# EAGLE design smartdoor (EAGLE 8.2.1)
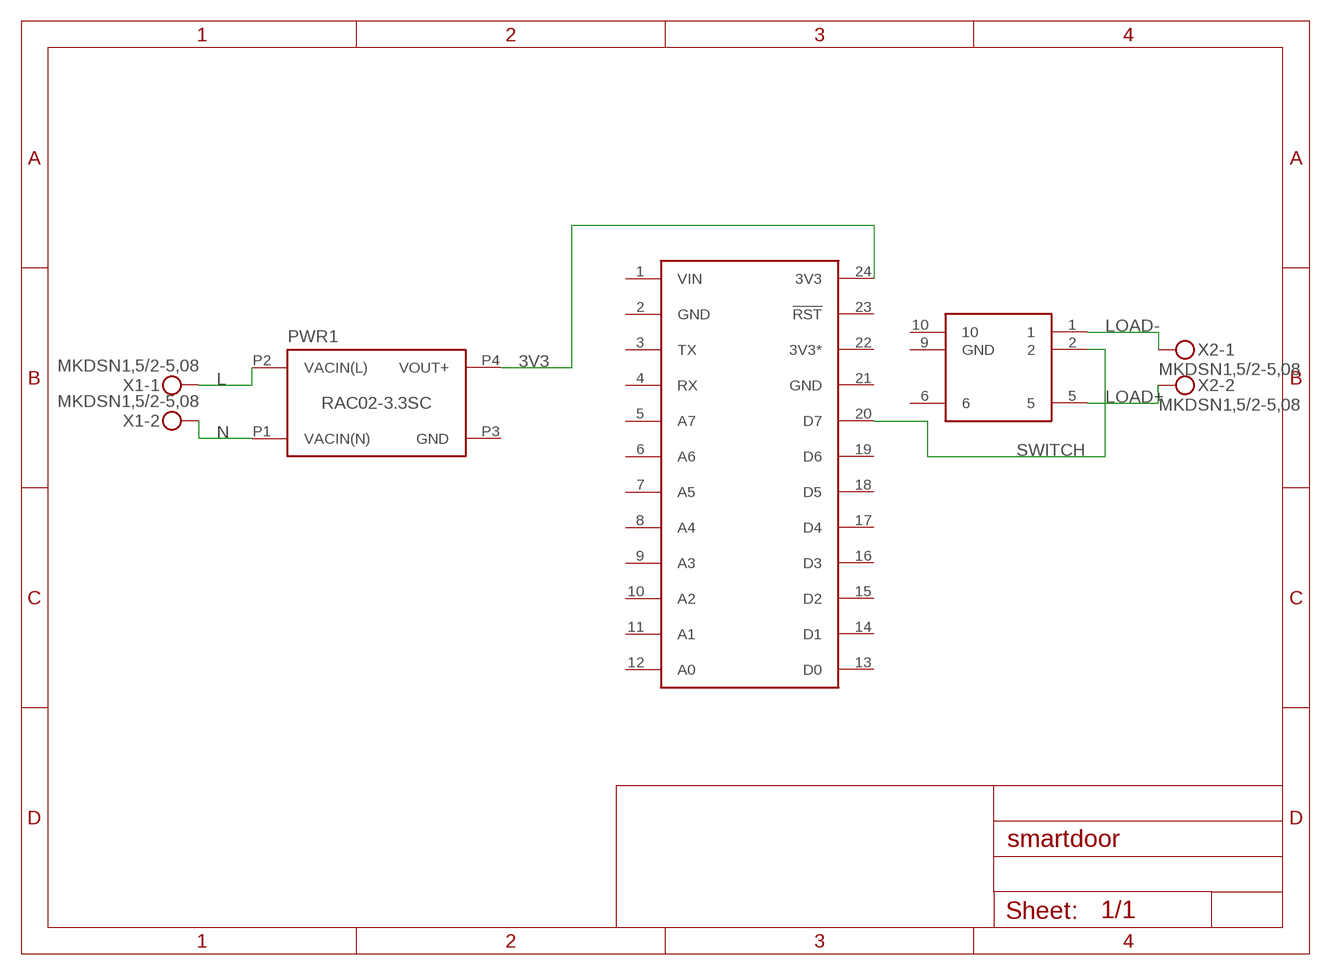
[diagram p0: schematic, sheet 1]

## Parts
CORE  SPARK_CORECORE  [SPARK_CORE]
PWR1  RAC02-3.3SC  [LOW_PROFILE_POWER_MODULE]
RELAY1  AZ9571AZ9571  [AZ9571]
X1  MKDSN1,5/2-5,08  [MKDSN1,5/2-5,08]
X2  MKDSN1,5/2-5,08  [MKDSN1,5/2-5,08]

## Nets
3V3: CORE.24(3V3) PWR1.P4(VOUT+)
L [hivoltage]: PWR1.P2(VACIN(L)) X1.1
LOAD+: RELAY1.5 X2.2
LOAD-: RELAY1.1 X2.1
N [hivoltage]: PWR1.P1(VACIN(N)) X1.2
SWITCH: CORE.20(D7) RELAY1.2
Unconnected: CORE.3(TX) CORE.4(RX) CORE.5(A7) CORE.6(A6) CORE.7(A5) CORE.8(A4) CORE.9(A3) CORE.10(A2) CORE.11(A1) CORE.12(A0) CORE.13(D0) CORE.14(D1) CORE.15(D2) CORE.16(D3) CORE.17(D4) CORE.18(D5) CORE.19(D6) CORE.23(!RST) RELAY1.6 RELAY1.10

## Power pins joined to a net without a drawn wire
3V3*: CORE.22(3V3*)
GND: CORE.2(GND) CORE.21(GND) PWR1.P3(GND) RELAY1.9(GND)
VIN: CORE.1(VIN)

## Library data of the parts
CORE = Particle:SPARK_CORE
PWR1 = recom-powerline-acdc-converters:RAC*SC: RECOM POWERLINE AC/DC-Converter (RAC01-SC and RAC02-SC series) The RAC01-SC and RAC02-SC series are ultra-compact universal input AC/DC power modules for PCB mounting. They feature high efficiency, low standby power, high operating temperature, soft start and short-circuit protection as well as a built-in EMC Class B filter. Output voltages range from 3.3VDC to 24VDC. Datasheet <http://www.recom-power.com/pdf/Powerline-AC-DC/RAC01_02-SC.pdf>; INPUT_RANGE: 80 - 277 (VAC); MAX_CAPACITIVE_LOAD: 2000uF; OUTPUT_CURRENT: 600mA; OUTPUT_VOLTAGE: 3.3v
RELAY1 = Zettler:AZ9571
X1 X2 = con-phoenix-508:MKDSN1,5/2-5,08: MKDSN 1,5/ 2-5,08 Printklemme Nennstrom: 13,5 A Nennspannung: 250 V Rastermaß: 5,08 mm Polzahl: 2 Anschlussart: Schraubanschluss Montage: Löten Anschlussrichtung Leiter/Platine: 0 ° Artikelnummer: 1729128 Source: http://eshop.phoenixcontact.com .. 1729128.pdf

## Net classes
0 default: width 0.61 mm, drill 0.61 mm, clearance 0.61 mm
1 hivoltage: width 1.016 mm, drill 0.61 mm, clearance 1.016 mm

## Board
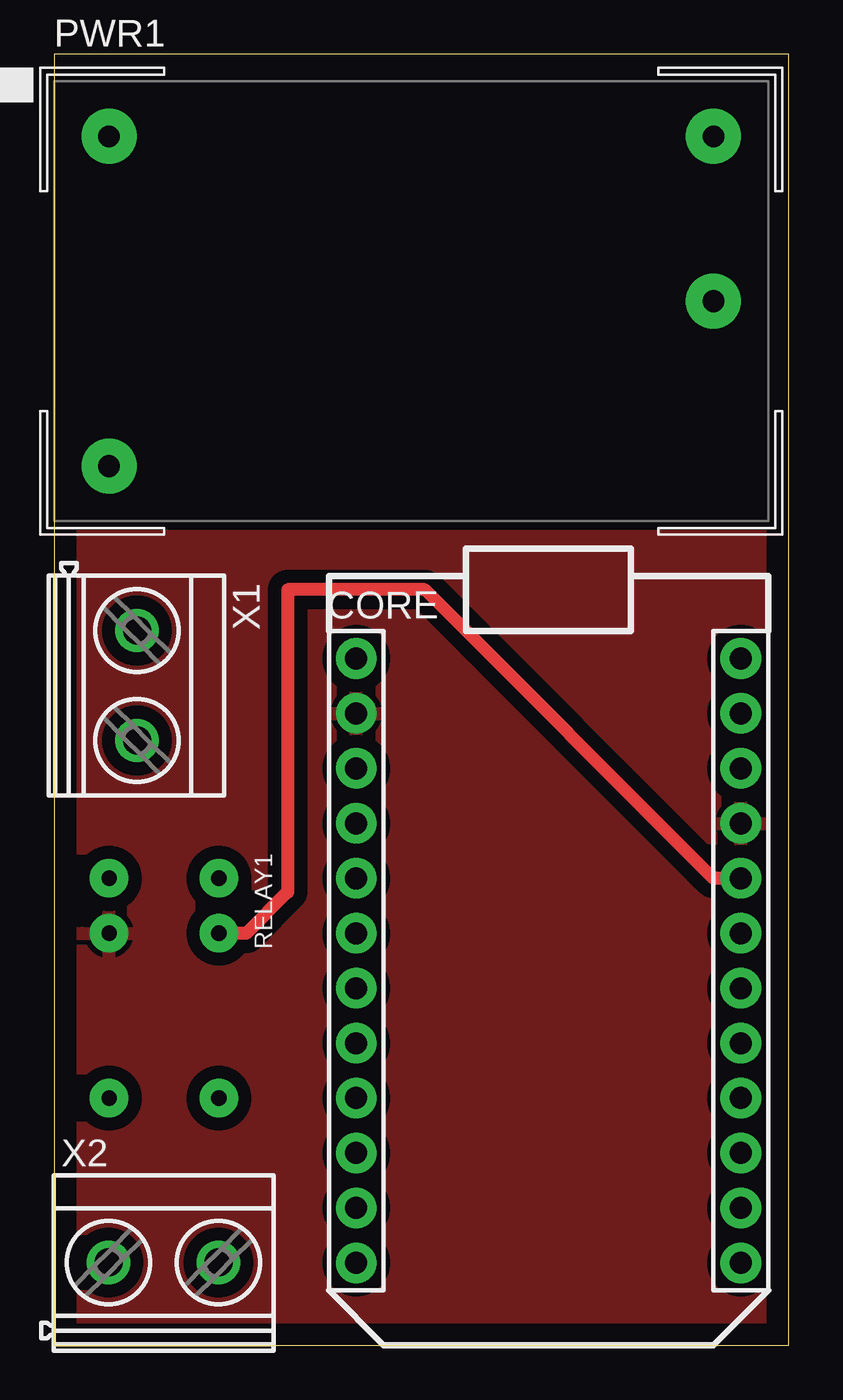
[diagram p1: board, top side]
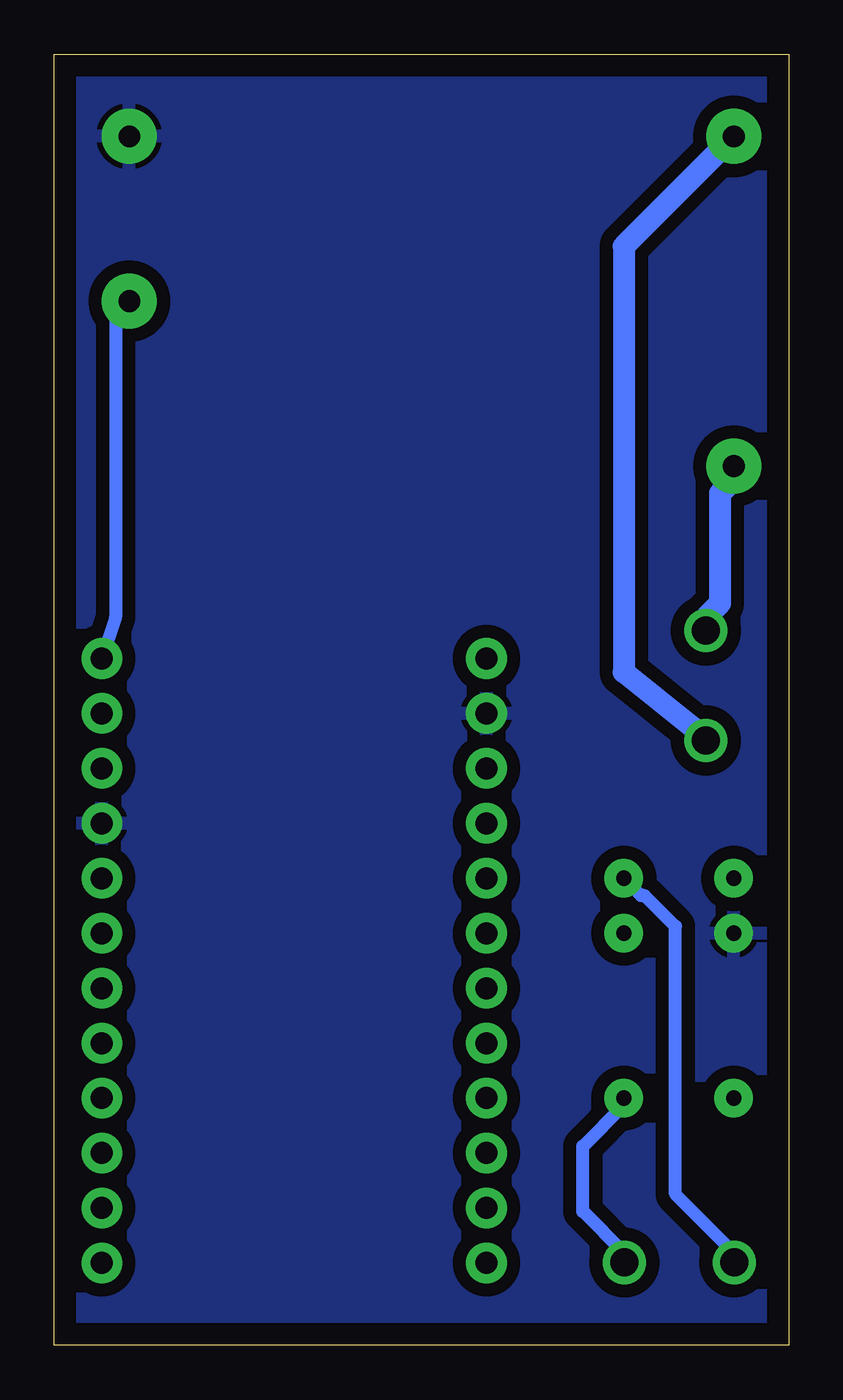
[diagram p2: board, bottom side, seen from below]

Size 33.96 x 59.68 mm. Coordinates in mm from the lower left corner, seen from the top.
Outline: 0,0 33.96,0 33.96,59.68 0,59.68 0,0
Copper layers (1*16): Top 0.035mm / dielectric 1.5mm / Bottom 0.035mm
Design rules "default": minimum track width 6mil, minimum drill 0.35mm, track to track 6mil, track to pad 6mil, pad to pad 6mil, via to via 6mil, smd to smd 6mil, copper to edge 40mil, drill to drill 6mil, minimum pad ring 10mil, minimum via ring 8mil, stop-mask expansion 4mil, vias tented up to drill 0mil, thermal gap 10mil

### Footprints (pad centres in the part's own frame; a part is rotated, then mirrored left to right if it is on the bottom)
SPARK_CORE = drill 1.016 pad 1.88: 1 -8.89,13.97; 2 -8.89,11.43; 3 -8.89,8.89; 4 -8.89,6.35; 5 -8.89,3.81; 6 -8.89,1.27; 7 -8.89,-1.27; 8 -8.89,-3.81; 9 -8.89,-6.35; 10 -8.89,-8.89; 11 -8.89,-11.43; 12 -8.89,-13.97; 13 8.89,-13.97; 14 8.89,-11.43; 15 8.89,-8.89; 16 8.89,-6.35; 17 8.89,-3.81; 18 8.89,-1.27; 19 8.89,1.27; 20 8.89,3.81; 21 8.89,6.35; 22 8.89,8.89; 23 8.89,11.43; 24 8.89,13.97
LOW_PROFILE_POWER_MODULE = drill 1 pad 2.54: P1 -12.7,7.62; P2 -12.7,-7.62; P3 15.24,7.62; P4 15.24,0
AZ9571 = drill 0.7 pad 1.778: 1 -5.08,2.54; 2 -2.54,2.54; 5 5.08,2.54; 6 5.08,-2.54; 9 -2.54,-2.54; 10 -5.08,-2.54
MKDSN1,5/2-5,08 = drill 1.3 pad 2: 1 -2.561,0.025; 2 2.519,0.025

### Placement (x,y rotation side)
CORE  22.86,17.78 0 top
PWR1  15.24,48.26 0 top
RELAY1  5.08,16.51 270 top
X1  3.81,30.48 270 top
X2  5.08,3.81 0 top

### Tracks (layer width: path | path; a pad name or v marks a point on that pad's centre or on a via)
3V3
  Bottom 0.61: CORE.24 31.11,33.66 31.11,47.62 PWR1.P4
GND
  pour Bottom (isolate 0.406): 0,0 34.29,0 34.29,59.69 0,59.69
  pour Top (isolate 0.406): 0,0 34.29,0 34.29,59.69 0,59.69
L
  Bottom 1.016: PWR1.P2 2.54,40.01 3.17,39.37 3.17,34.29 3.81,33.66 X1.1
LOAD+
  Bottom 0.61: RELAY1.5 7.62,11.11 9.53,9.21 9.53,6.19 7.62,4.29 7.62,3.97 X2.2
LOAD-
  Bottom 0.61: RELAY1.1 6.83,20.8 6.67,20.8 5.24,19.37 5.24,6.99 2.54,4.29 2.54,3.97 X2.1
N
  Bottom 1.016: PWR1.P1 2.54,55.24 3.17,55.24 7.62,50.8 7.62,31.11 4.45,28.57 X1.2
SWITCH
  Top 0.61: RELAY1.2 8.89,19.05 10.79,20.95 10.79,34.92 17.14,34.92 30.48,21.59 CORE.20